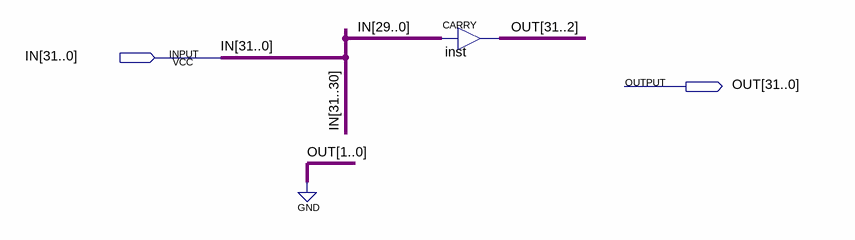
[diagram p0: schematic sheet]
// Quartus schematic leftshift.bdf as structural Verilog: 1 symbols, 2 pins
module leftshift (
  input  [31:0] IN,
  output [31:0] OUT
);

  CARRY inst[29:0] (.IN(IN[29:0]), .OUT(OUT[31:2]));

  assign OUT[1:0] = 2'b00;
endmodule
